# Altium schematic sheet Fonte.SchDoc
size A3
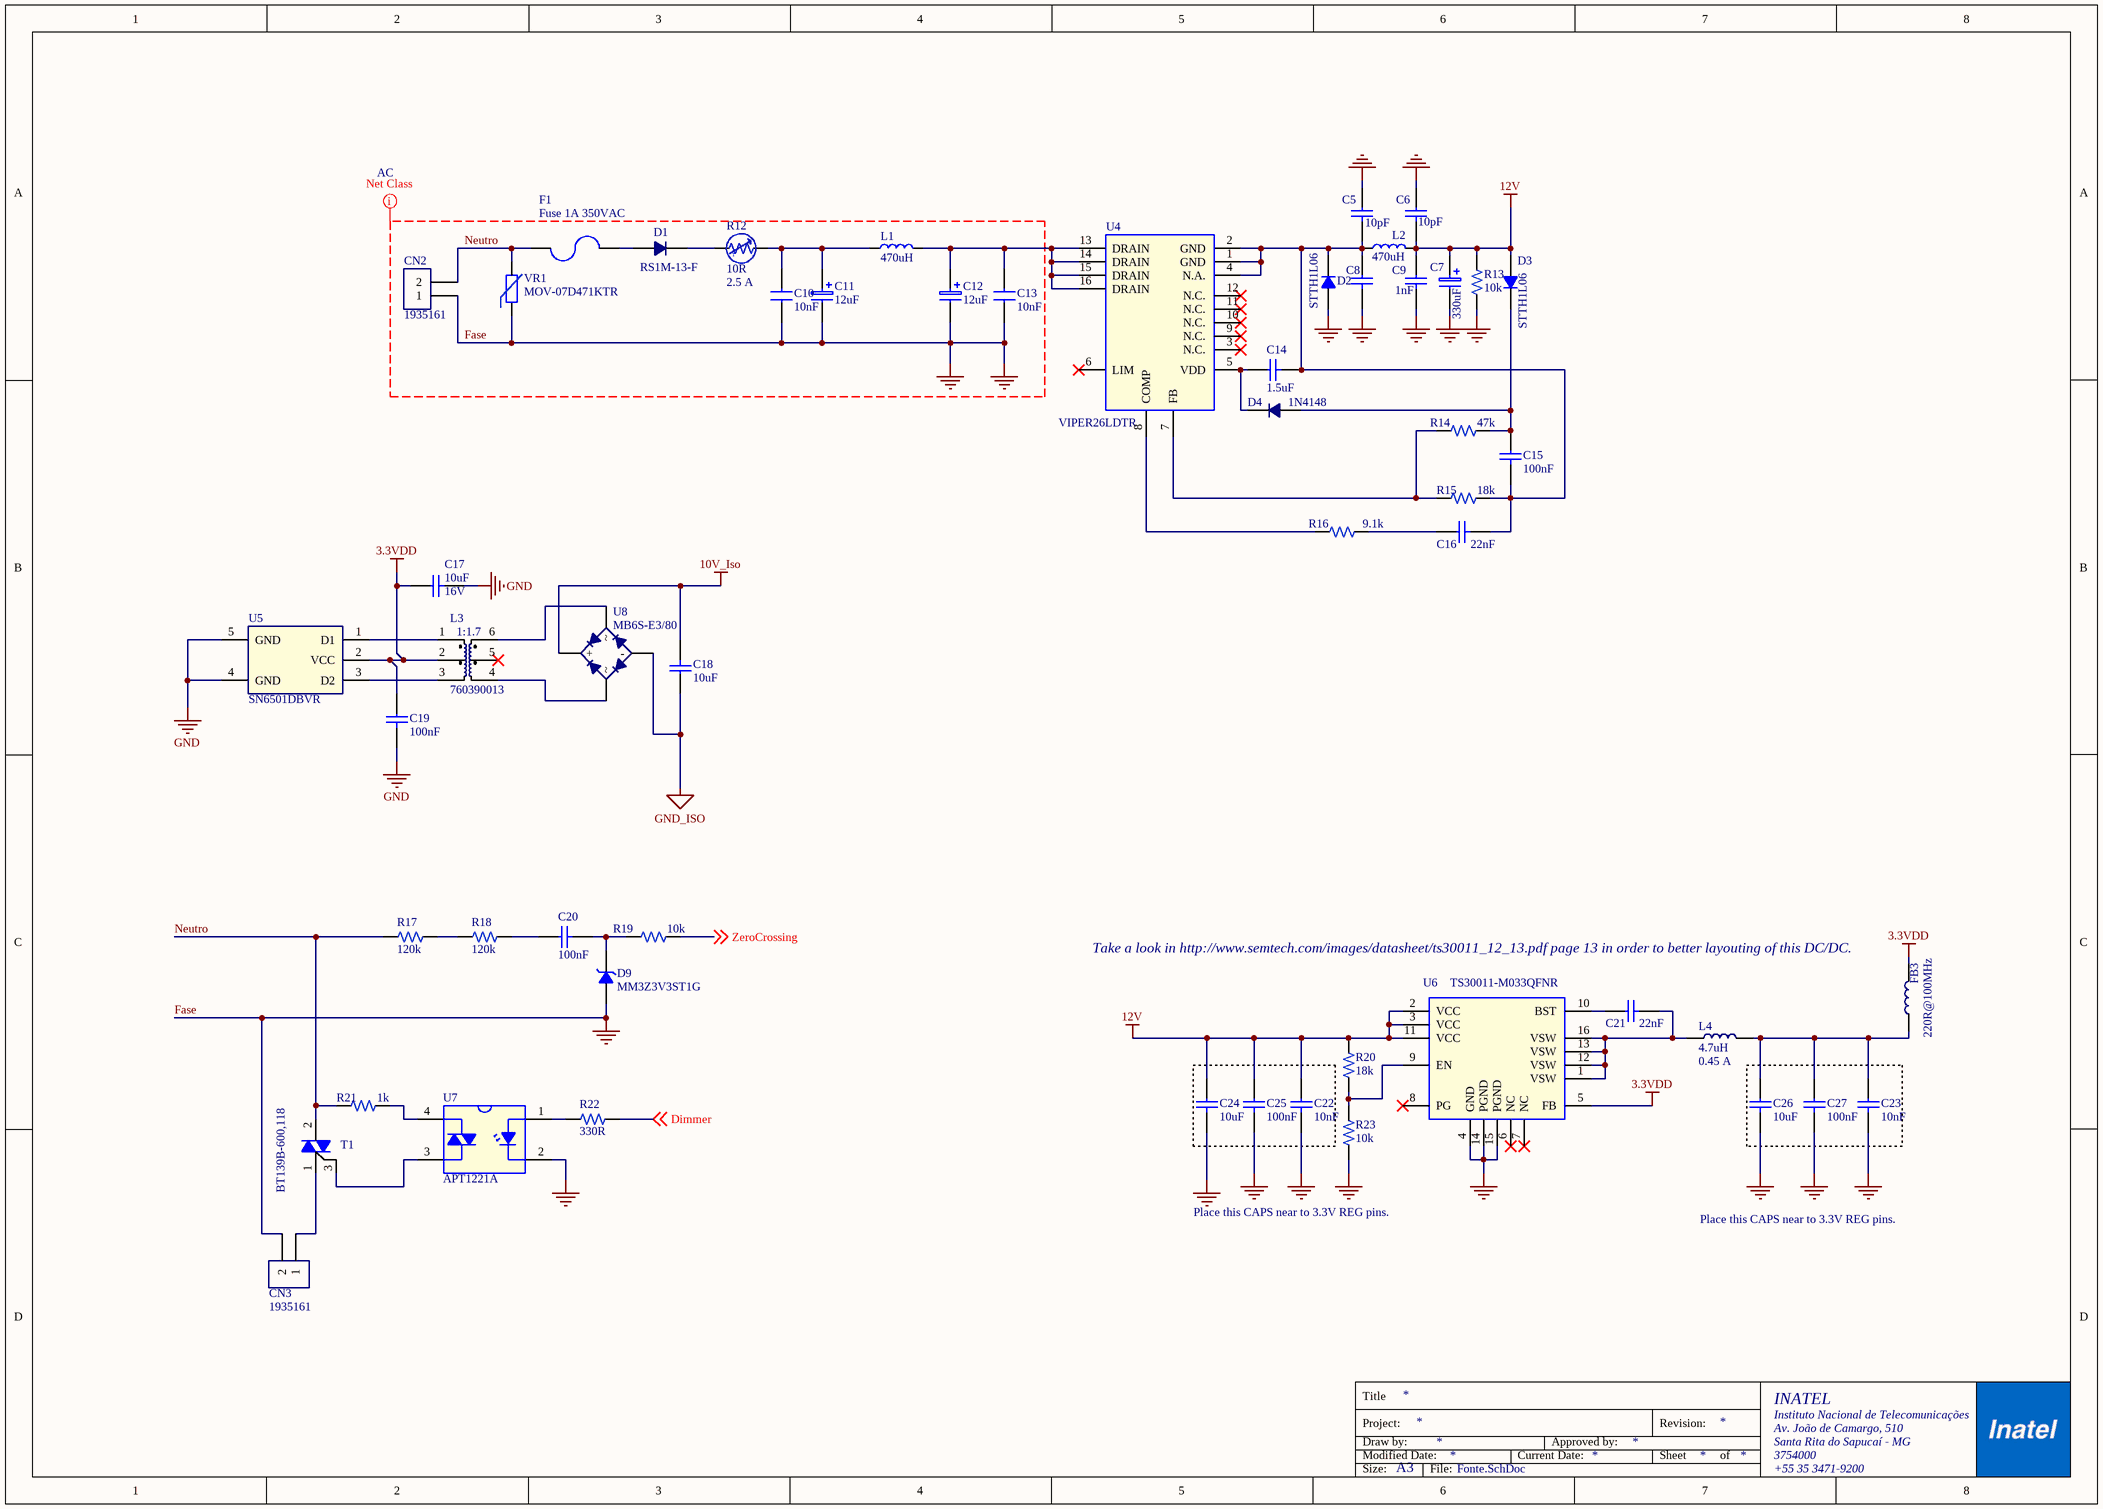
[diagram p0: Fonte.SchDoc]

## Parts
C5  10pF  [0603-3D]
C6  10pF  [0603-3D]
C7  330uF  [CAP-RADIAL-630Dx1500Hx250P-3D]
C8  1nF  [0603-3D]  (value not drawn)
C9  1nF  [0603-3D]
C10  value 10nF  [CAP-RADIAL-5mm]  (hidden comment: CAP FILM 10000PF 5% 630VDC RAD)
C11  12uF  [CAP-RADIAL-1000Dx1750Hx500P-3D]
C12  12uF  [CAP-RADIAL-1000Dx1750Hx500P-3D]
C13  value 10nF  [CAP-RADIAL-5mm]  (hidden comment: CAP FILM 10000PF 5% 630VDC RAD)
C14  1.5uF  [1206-Ceramic-3D]
C15  100nF  [0603-3D]
C16  22nF  [0603-3D]
C17  Voltage: 16V  [CAP-0603-3D]  (hidden comment: 10uF)
C18  10uF  [CAP-0603-3D]
C19  100nF  [0603-3D]
C20  100nF  [0603-3D]
C21  22nF  [0603-3D]
C22  10nF  [0603-3D]
C23  10nF  [0603-3D]
C24  10uF  [CAP-0603-3D]
C25  100nF  [0603-3D]
C26  10uF  [CAP-0603-3D]
C27  100nF  [0603-3D]
CN2  1935161  [TERM BLOCK PCB 2POS 5.0MM]
CN3  1935161  [TERM BLOCK PCB 2POS 5.0MM]
D1  value RS1M-13-F  [DO-214AC_SMA-3D]  (hidden comment: DIODE GEN PURP 1KV 1A SMA)
D2  STTH1L06  [DO-214AC_SMA-3D]
D3  STTH1L06  [DO-214AC_SMA-3D]
D4  1N4148  [SOD323-3D]
D9  MM3Z3V3ST1G  [SOD323-3D]
F1  Fuse 1A 350VAC  [Fuse-SMD-610L254W279H-3D]
FB3  220R@100MHz  [IND-0603-3D]
L1  470uH  [IND_620W590L450H_CLF6045]
L2  470uH  [IND_620W590L450H_CLF6045]
L3  value 760390013  [TRAFO-DC/DC-CONVERTERS-3D]  (hidden comment: TRANSFORMER 475UH SMD)
L4  value 4.7uH  Current Rating: 0.45 A  [IND-1210-PWR-3D]  (hidden comment: FIXED IND 4.7UH 450MA 200 MOHM)
R12  Current: 2.5 A  [NTC-800D500W-500P-3D]  (hidden comment: 10R)
R13  10k  [0603-3D]
R14  47k  [0603-3D]
R15  18k  [0603-3D]
R16  9.1k  [0603-3D]
R17  120k  [RES-1206-3D]
R18  120k  [RES-1206-3D]
R19  10k  [0603-3D]
R20  18k  [0603-3D]
R21  1k  [0805-3D]
R22  value 330R  [0603-3D]  (hidden comment: RES SMD 330 OHM 5% 1/10W 0603)
R23  10k  [0603-3D]
T1  value BT139B-600,118  [D2PAC-3D]  (hidden comment: TRIAC 600V 16A D2PAK)
U4  VIPER26LDTR  [SO16N-3D]
U5  value SN6501DBVR  [SOT23-5]  (hidden comment: IC REG CONV PWR SUPPLIES SOT23-5)
U6  TS30011-M033QFNR  [16VQFN-3D]
U7  APT1221A  [DIP4-SMD]
U8  value MB6S-E3/80  [TO-269AA-3D]  (hidden comment: Bridge Rectifier Single Phase 600V 500mA Surface Mount TO-269AA (MBS))
VR1  MOV-07D471KTR  [VAR-05D-SERIES-PTH-3D]

## Nets
3.3VDD: C17.1 C19.1 FB3.2 L3.2 U5.2(VCC) U6.5(FB)
10V_Iso: C18.2 U8.3(+)
12V: C6.2 C7.1 C9.1 C22.1 C24.1 C25.1 D3.1 L2.2 R13.2 R20.2 U6.2(VCC) U6.3(VCC) U6.11(VCC)
Fase: C5.1 C6.1 C7.2 C8.2 C9.2 C10.2 C11.2 C12.2 C13.2 C17.2 C19.2 C22.2 C23.2 C24.2 C25.2 C26.2 C27.2 CN2.1 CN3.2 D2.1 D9.1 R13.1 R23.1 U5.4(GND) U5.5(GND) U6.4(GND) U6.14(PGND) U6.15(PGND) U7.2(K) VR1.1  [also labelled GND]
GND_ISO: C18.1 U8.4(-)
Dimmer: R22.2 ; off-sheet Dimmer
Neutro: CN2.2 F1.2 R17.1 R21.2 T1.2(T2) VR1.2
ZeroCrossing: R19.2 ; off-sheet ZeroCrossing
NetC5_2: C5.2 C8.1 C14.2 C15.2 C16.2 D2.2 L2.1 R15.2 U4.1(GND) U4.2(GND) U4.4(N.A.)
NetC10_1: C10.1 C11.1 L1.1 R12.2
NetC12_1: C12.1 C13.1 L1.2 U4.13(DRAIN) U4.14(DRAIN) U4.15(DRAIN) U4.16(DRAIN)
NetC14_1: C14.1 D4.2 U4.5(VDD)
NetC15_1: C15.1 D3.2 D4.1 R14.2
NetC16_1: C16.1 R16.2
NetC20_1: C20.1 R18.2
NetC20_2: C20.2 D9.2 R19.1
NetC21_1: C21.1 U6.10(BST)
NetC21_2: C21.2 L4.1 U6.1(VSW) U6.12(VSW) U6.13(VSW) U6.16(VSW)
NetC23_1: C23.1 C26.1 C27.1 FB3.1 L4.2
NetCN3_1: CN3.1 T1.1(T1)
NetD1_1: D1.1 F1.1
NetD1_2: D1.2 R12.1
NetL3_1: L3.1 U5.1(D1)
NetL3_3: L3.3 U5.3(D2)
NetL3_4: L3.4 U8.1
NetL3_6: L3.6 U8.2
NetR14_1: R14.1 R15.1 U4.7(FB)
NetR16_1: R16.1 U4.8(COMP)
NetR17_2: R17.2 R18.1
NetR20_1: R20.1 R23.2 U6.9(EN)
NetR21_1: R21.1 U7.4(T2)
NetR22_1: R22.1 U7.1(A)
NetT1_3: T1.3(G) U7.3(MT2)

Not connected (* = marked no-connect by the designer): L3 5*; U4 3(N.C.)* 6(LIM)* 9(N.C.)* 10(N.C.)* 11(N.C.)* 12(N.C.)*; U6 6(NC)* 7(NC)* 8(PG)*

## Layout directives
net class AC: (no net found under the mark)

## Notes on the sheet
- (near FB3) Take a look in http://www.semtech.com/images/datasheet/ts30011_12_13.pdf page 13 in order to better layouting of this DC/DC.
- Place this CAPS near to 3.3V REG pins.
- Title
- Modified Date:
- Project:
- Draw by:
- Current Date:
- Approved by:
- Sheet
- Revision:
- of
- Instituto Nacional de Telecomunicações
- Av. João de Camargo, 510
- Santa Rita do Sapucaí - MG
- 3754000
- INATEL
- Size:
- A3
- File:
- +55 35 3471-9200
- (in symbol 760390013 TRANSFORMER 475UH SMD) 1:1.7
- (in symbol SL08 10002 NTC 10R 20% 2.5A 8MM) T

## Library data of the parts
C5 C6 = 10pF 1% 0603 MLCC NPO 50V: CAP CER 10PF 50V NP0 0603; User: Rodrigo Villela; Code: *; Creation Date: 2015/12/01; Version: V01; Size: 0603; Voltage: 50V; Supplier 1: Digi-Key; Value: 10pF; Supplier Part Number 1: 1276-2152-1-ND
C7 = 330uF 20% RADIAL PTH 16V: CAP 330 UF 20% 16 V; User: Jean Pierre; Voltage: 16V; Code: *; Creation Date: 2016/07/08; Version: V01; Size: RADIAL, CAN - PTH; Supplier 1: Digi-Key; Supplier Part Number 1: 732-9474-1-ND; Value: 330uF
C8 C9 = 1000pF 5% 0603 MLCC NP0 50V: CAP CER 1000PF 50V 5% NP0 0603; User: Anderson Daniel Soares; Code: *; Creation Date: 2015/01/27; Version: V01; Supplier 1: Digi-Key; Supplier Part Number 1: 490-4768-1-ND; Voltage: 50V; Size: 0603; Value: 1nF
C10 C13 = 10nF 5% RADIAL FILM 400VAC: User: Ricardo Dias; Voltage: 400VAC; Code: *; Creation: 2016/02/19; Version: V01; Size: Radial; Supplier 1: Digi-Key; Supplier Part Number 1: 495-1262-ND
C11 C12 = 12uF 20% RADIAL PTH 350V: CAP ALUM 12UF 20% 350V RADIAL; User: Ricardo Dias; Code: *; Creation Date: 2016/06/08; Version: V01; Size: RADIAL, CAN - PTH; Voltage: 350V; Supplier 1: Digi-Key; Supplier Part Number 1: 565-3506-ND; Value: 12uF
C14 = 1.5uF 10% 1206 MLCC X7R 50V: CAP CER 1.5UF 50V X7R 1206; User: Ricardo Dias; Code: *; Creation Date: 2016/06/08; Version: V01; Size: 1206; Voltage: 50V; Supplier 1: Digi-Key; Supplier Part Number 1: 445-6985-1-ND; Value: 1.5uF
C15 = 0.1uF 10% 0603 MLCC X7R 50V KEMET: 0.1µF ±10% 50V Ceramic Capacitor X7R 0603 (1608 Metric); User: Ricardo Dias; Code: *; Creation Date: 2017/10/06; Version: V01; Size: 0603; Voltage: 50V; Supplier 1: Digi-Key; Supplier 2: Mouser; Supplier 3: Newark; Supplier Part Number 1: 399-5089-1-ND; Supplier Part Number 2: 80-C0603C104K5R; Supplier Part Number 3: 72J5992; Value: 100nF
C16 C21 = 0.022uF 20% 0603 MLCC X7R 16V: 0.022µF 16V Ceramic Capacitor X7R 0603; User: Jean Pierre; Code: *; Creation Date: 2016/08/16; Supplier 1: Digi-Key; Supplier Part Number 1: 445-5115-1-ND; Size: 0603; Voltage: 16V; Value: 22nF
C17 C18 C24 C26 = 10uF 20% 0603 MLCC X5R 16V: CAP CER 10UF 16V 20% X5R 0603; User: Mateus Elias; Code: *; Creation Date: 2014/10/07; Supplier 1: Digi-Key; Supplier 2: Mouser; Supplier 3: Newark; Supplier Part Number 1: 490-7201-1-ND; Supplier Part Number 2: 963-EMK107BBJ106MA-T; Supplier Part Number 3: 68X2787; Version: V01; Size: 0603; Value: 10uF
  C18 C24 C26: Voltage: 16V
C19 C20 C25 C27 = 0.1uF 10% 0603 MLCC X7R 50V: CAP CER 0.1UF 50V 10% X7R 0603; User: Anderson Daniel Soares; Code: *; Creation Date: 2015/01/23; Version: V01; Supplier 1: Digi-Key; Supplier Part Number 1: 445-5666-6-ND; Supplier 2: Mouser; Supplier Part Number 2: 810-CGA3E2X7R1H104K; Supplier 3: Newark; Supplier Part Number 3: 04X3156; Size: 0603; Voltage: 50V; Value: 100nF
C22 C23 = 10000pF 10% 0603 MLCC X7R 50V KEMET: 10000pF ±10% 16V Ceramic Capacitor X7R 0603 (1608 Metric); User: Ricardo Dias; Voltage: 50V; Code: *; Creation Date: 2017/10/06; Version: V01; Size: 0603; Supplier 1: Digi-Key; Supplier 2: Mouser; Supplier Part Number 1: 399-7841-1-ND; Supplier Part Number 2: 80-C0603C103K4R; Value: 10nF
CN2 CN3 = 1935161  TERM BLOCK PCB 2X1: TERM BLOCK PCB 2POS 5.0MM; User: Rodrigo Balbi; Code: *; Creation Date: 2015/11/30; Size: -; Version: V02; Supplier 1: Digikey; Supplier Part Number 1: 277-1667-ND; Supplier 2: Mouser; Supplier 3: Newarc; Supplier Part Number 2: 651-1935161; Supplier Part Number 3: 70R0063; Value: 1935161
D1 = RS1M-13-F DIODE GEN PURP 1KV 1A SMA: Manufacturer: Diodes Incorporated; User: Pedro Vilela; Size: DO-214AC, SMA; Code: *; Creation Date: 2018/09/28; Version: V03; Supplier 1: Digi-Key; Supplier 2: Mouser; Supplier 3: Newark; Supplier Part Number 2: 621-RS1M-13-F; Supplier Part Number 3: 23T8374; Supplier Part Number 1: RS1M-FDICT-ND; Manufacturer Part Number: RS1M-13-F; ComponentLink1Description: RS1M-FDICT-ND; ComponentLink1URL: https://www.digikey.com/products/en?keywords=RS1M-FDICT-ND
D2 D3 = STTH1L06 TURBO 2 ULTRAFAST HIGH VOLTAGE RECTIFIER: DIODE GEN PURP 600V 1A SMA; User: Rafael Magalhães de Barros; Code: *; Creation Date: 2016/02/26; Size: SMA; Version: V01; Supplier 1: Digi-Key; Supplier Part Number 1: 497-3241-1-ND; Supplier 2: Mouser; Supplier Part Number 2: 511-STTH1L06A; Value: STTH1L06
D4 = 1N4148 FAST SWITCHING DIODE: DIODE SWITCHING 75V 0.15A SOD323; User: Mateus Elias; Code: *; Creation Date: 2014/10/27; Size: SOD323; Supplier 1: Digi-Key; Supplier 2: Mouser; Supplier 3: Newark; Supplier Part Number 1: 1N4148WS-E3-08CT-ND; Supplier Part Number 2: 78-1N4148WS-E3-08; Supplier Part Number 3: 35K9699; Version: V01; Value: 1N4148
D9 = MM3Z3V3ST1G 3.3V DIODE ZENER: DIODE ZENER 3.3V 200MW SOD323; User: Ricardo Dias; Code: *; Creation Date: 2016/06/07; Size: SOD323; Version: V01; Supplier 1: Digi-Key; Supplier Part Number 1: MM3Z3V3ST1GOSCT-ND; Value: MM3Z3V3ST1G
F1 = Fuse Board SMD2410 350VAC 72VDC: FUSE BOARD MNT 1A 350VAC 72VDC; User: Mateus Elias; Code: *; Creation Date: 2015/11/23; Size: 610L254W279H; Version: V01; Supplier 1: Digi-Key; Supplier Part Number 1: 507-2046-1-ND; Value: Fuse 1A 350VAC
FB3 = 220R@100MHz 0603 FB 0.05R 2A: FERRITE CHIP 0603 220 OHM; User: Jean Pierre; Current Rating: 2A; Code: *; Creation Date: 2015/05/05; Version: V01; Size: 0603; Supplier 1: Digi-Key; Supplier Part Number 1: 445-1565-1-ND; Value: 220R@100MHz
L1 L2 = 470uH 20% SMDPWR WW 0.37A: FIXED IND 470UH 370MA 1.42 OHM; User: Jean Pierre; Code: *; Creation Date: 2016/07/11; Version: V01; Size: 6.2mm x 5.9mm  x 4.5mm; Current Rating: 370 mA; Supplier 1: Digi-Key; Supplier Part Number 1: 445-15102-1-ND; Value: 470uH
L3 = 760390013 TRANSFORMER 475UH SMD: User: Ricardo Dias; Code: *; Creation Date: 2017/09/06; Version: V01; Size: 0603; Supplier 1: Digi-Key; Supplier 2: Mouser; Supplier Part Number 1: 732-4457-1-ND; Supplier Part Number 2: 710-760390013
L4 = 4.7uH SMD WW 0.2R 0.45A: User: Jean Pierre; Code: *; Creation Date: 2015/05/11; Version: V01; Size: 320L250W170H; Supplier 1: Digi-Key; Supplier Part Number 1: 490-2495-1-ND
R12 = SL08 10002 NTC 10R 20% 2.5A 8MM: ICL 10 OHM 20% 2.5A 8MM; User: Jean Pierre; Code: *; Creation Date: 2016/09/23; Version: V01; Size: 800D500W; Tolerance: 20%; Supplier 1: Digi-Key; Supplier Part Number 1: 570-1094-ND; Value: 10R
R13 R19 R23 = 10k 1% 0603 TNF 1/10W: RES SMD 10K OHM 1% 1/10W 0603; Manufacturer: Yageo; Manufacturer Part Number: RC0603FR-0710KL; User: Pedro Vilela; Code: *; Creation Date: 2018/09/28; Version: V03; Size: 0603; Supplier 1: Digi-Key; Supplier 2: Mouser; Supplier 3: Newark; Supplier Part Number 1: 311-10.0KHRCT-ND; Supplier Part Number 2: 603-RC0603FR-0710KL; Supplier Part Number 3: 68X3181; Tolerance: 1%; ComponentLink1Description: 311-10.0KHRCT-ND; ComponentLink1URL: https://www.digikey.com/products/en?keywords=311-10.0KHRCT-ND; Value: 10k
R14 = 47k 1% 0603 TKF 1/16W: RES SMD 47K OHM 1% 1/10W 0603; User: Anderson Daniel Soares; Code: *; Creation Date: 2015/01/27; Supplier Link 1: http://www.digikey.com/product-search/en?pv7=2&k=311-47.0KHRCT-ND&mnonly=0&newproducts=0&ColumnSort=0&page=1&stock=1&quantity=0&ptm=0&fid=0&pageSize=25; Supplier Link 2: http://br.mouser.com/ProductDetail/Panasonic/ERJ-3EKF4702V/?qs=%2fha2pyFadujWqMGonbcVXdO432yyH%2fwnIoCZHha2gphIl1D2ssXdow%3d%3d; Supplier Link 3: http://www.newark.com/panasonic-electronic-components/erj-3ekf4702v/thick-film-resistor-47kohm-100mw/dp/64R5350?ost=64R5350; Version: V01; Supplier 1: Digi-Key; Supplier Part Number 1: 311-47.0KHRCT-ND; Supplier 2: Mouser; Supplier Part Number 2: 667-ERJ-3EKF4702V; Supplier 3: Newark; Supplier Part Number 3: 64R5350; Size: 0603; Value: 47k
R15 R20 = 18k 1% 0603 TKF 1/10W: RES SMD 18K OHM 1% 1/10W 0603; User: Ricardo Dias; Creation Date: 2015/06/16; Version: V01; Size: 0603; Supplier 1: Digi-Key; Supplier Part Number 1: 1276-4765-1-ND; Value: 18k; Tolerance: 1%
R16 = 9.1k 1% 0603 TKF 1/10W: RES SMD 9.1K OHM 1% 1/10W 0603; User: Ricardo Dias; Creation Date: 2015/06/10; Version: V01; Size: 0603; Supplier 1: Digi-Key; Supplier Part Number 1: RHM9.1KCLDKR-ND; Value: 9.1k
R17 R18 = 120k 5% 1206 TKF 1/4W: RES SMD 120K OHM 5% 1/4W 1206; User: Rodrigo Villela; Code: *; Creation Date: 19/11/2016; Version: V01; Size: 1206; Tolerance: 5%; Supplier 1: Digi-Key; Value: 120k; Supplier Part Number 1: 311-120KERDKR-ND
R21 = 1k 1% 0805 TKF 1/8W: RES SMD 1K OHM 1% 1/8W 0805; User: Mateus Elias; Code: *; Creation Date: 2015/10/14; Supplier Link 1: http://www.digikey.com/product-detail/en/RC0805FR-071KL/311-1.00KCRCT-ND/730391; Version: V01; Supplier 1: Digi-Key; Supplier Part Number 1: 311-1.00KCRCT-ND; Size: 0805; Value: 1k
R22 = 330R 5% 0603 TKF 1/10W: User: Luiz F Siecola; Code: *; Creation Date: 2017/05/03; Version: V02; Size: 0603; Supplier 1: Digi-Key; Supplier Part Number 1: P330GCT-ND; Tolerance: 5%; Supplier 2: Mouser; Supplier 3: Newark; Supplier Part Number 2: 667-ERJ-3GEYJ331V; Supplier Part Number 3: 65T8629
T1 = BT139B-600,118 TRIAC GEN PURPOSE: User: Jean Pierre; Size: D2PAK, TO-263; Code: *; Creation Date: 2016/06/03; Version: V01; Supplier 1: Digi-Key; Supplier Part Number 1: 568-12230-1-ND
U4 = VIPER26LDTR CONVERTER CA/CC FIXED FREQ: IC OFFLINE CONV PWM 800V 16-SOIC; User: Ricardo Dias; Code: *; Creation Date: 2016/05/25; Size: SOIC16; Version: V01; Supplier 1: Digi-Key; Supplier Part Number 1: VIPER26LDCT-ND; Value: VIPER26LDTR
U5 = SN6501DBVR REG CONV ISO PWR SUPPLIES SOT23-5: User: Ricardo Dias; Code: *; Creation Date: 20150610; Size: SOT23-5; Version: V01; Supplier 1: Digi-Key; Supplier 2: Mouser; Supplier Part Number 1: 296-37700-6-ND; Supplier Part Number 2: 595-SN6501DBVR
U6 = TS30011-M033QFNR DC/DC 3.3V FIX 1A 1.5MHz: IC REG BUCK 3.3V 1A SYNC 16-VQFN; User: Ricardo Dias; Code: *; Creation Date: 2016/06/09; Size: 16VQFN; Version: V01; Value: TS30011-M033QFNR; Supplier 1: Digi-Key; Supplier Part Number 1: TS30011-M033QFNRCT-ND
U7 = APT1221A: Optoisolator Triac Output 5000Vrms 1 Channel 4-SMD; User: Luiz Fernando; Code: *; Creation Date: 2017/02/01; Version: V01; Supplier 1: Digi-Key; Supplier Part Number 1: 255-1522-5-ND; Value: APT1221A
U8 = MB6S-E3/80 BRIDGE RECTIFIER SINGLE: User: Reis; Creation Date: 2017/05/08; Descrition: Bridge Rectifier Single Phase 600V 500mA Surface Mount TO-269AA (MBS); Size: TO-269AA (MBS); Supplier 1: Digi-Key; Code: *; Version: V0.2; Supplier 2: Mouser; Supplier 3: Newark; Supplier Part Number 1: MB6S-E3/80GICT-ND; Supplier Part Number 2: 625-MB6S-E3/80; Supplier Part Number 3: 75R2117
VR1 = MOV-07D471KTR VAR 470V 1.2KA DISC 7MM: MOV-07D471KTR - VARISTOR 470V 1.2KA DISC 7MM; User: Luiz F Siecola; Code: *; Creation Date: 2017/08/30; Size: 400W800L1100H; Supplier 1: Digi-Key; Supplier 2: Mouser; Supplier 3: Newark; Supplier Part Number 1: MOV-07D471KTRCT-ND; Supplier Part Number 2: 652-MOV-07D471KTR; Version: V01; Value: MOV-07D471KTR